# EAGLE design SlimeVRDiyModular (EAGLE 9.6.2)
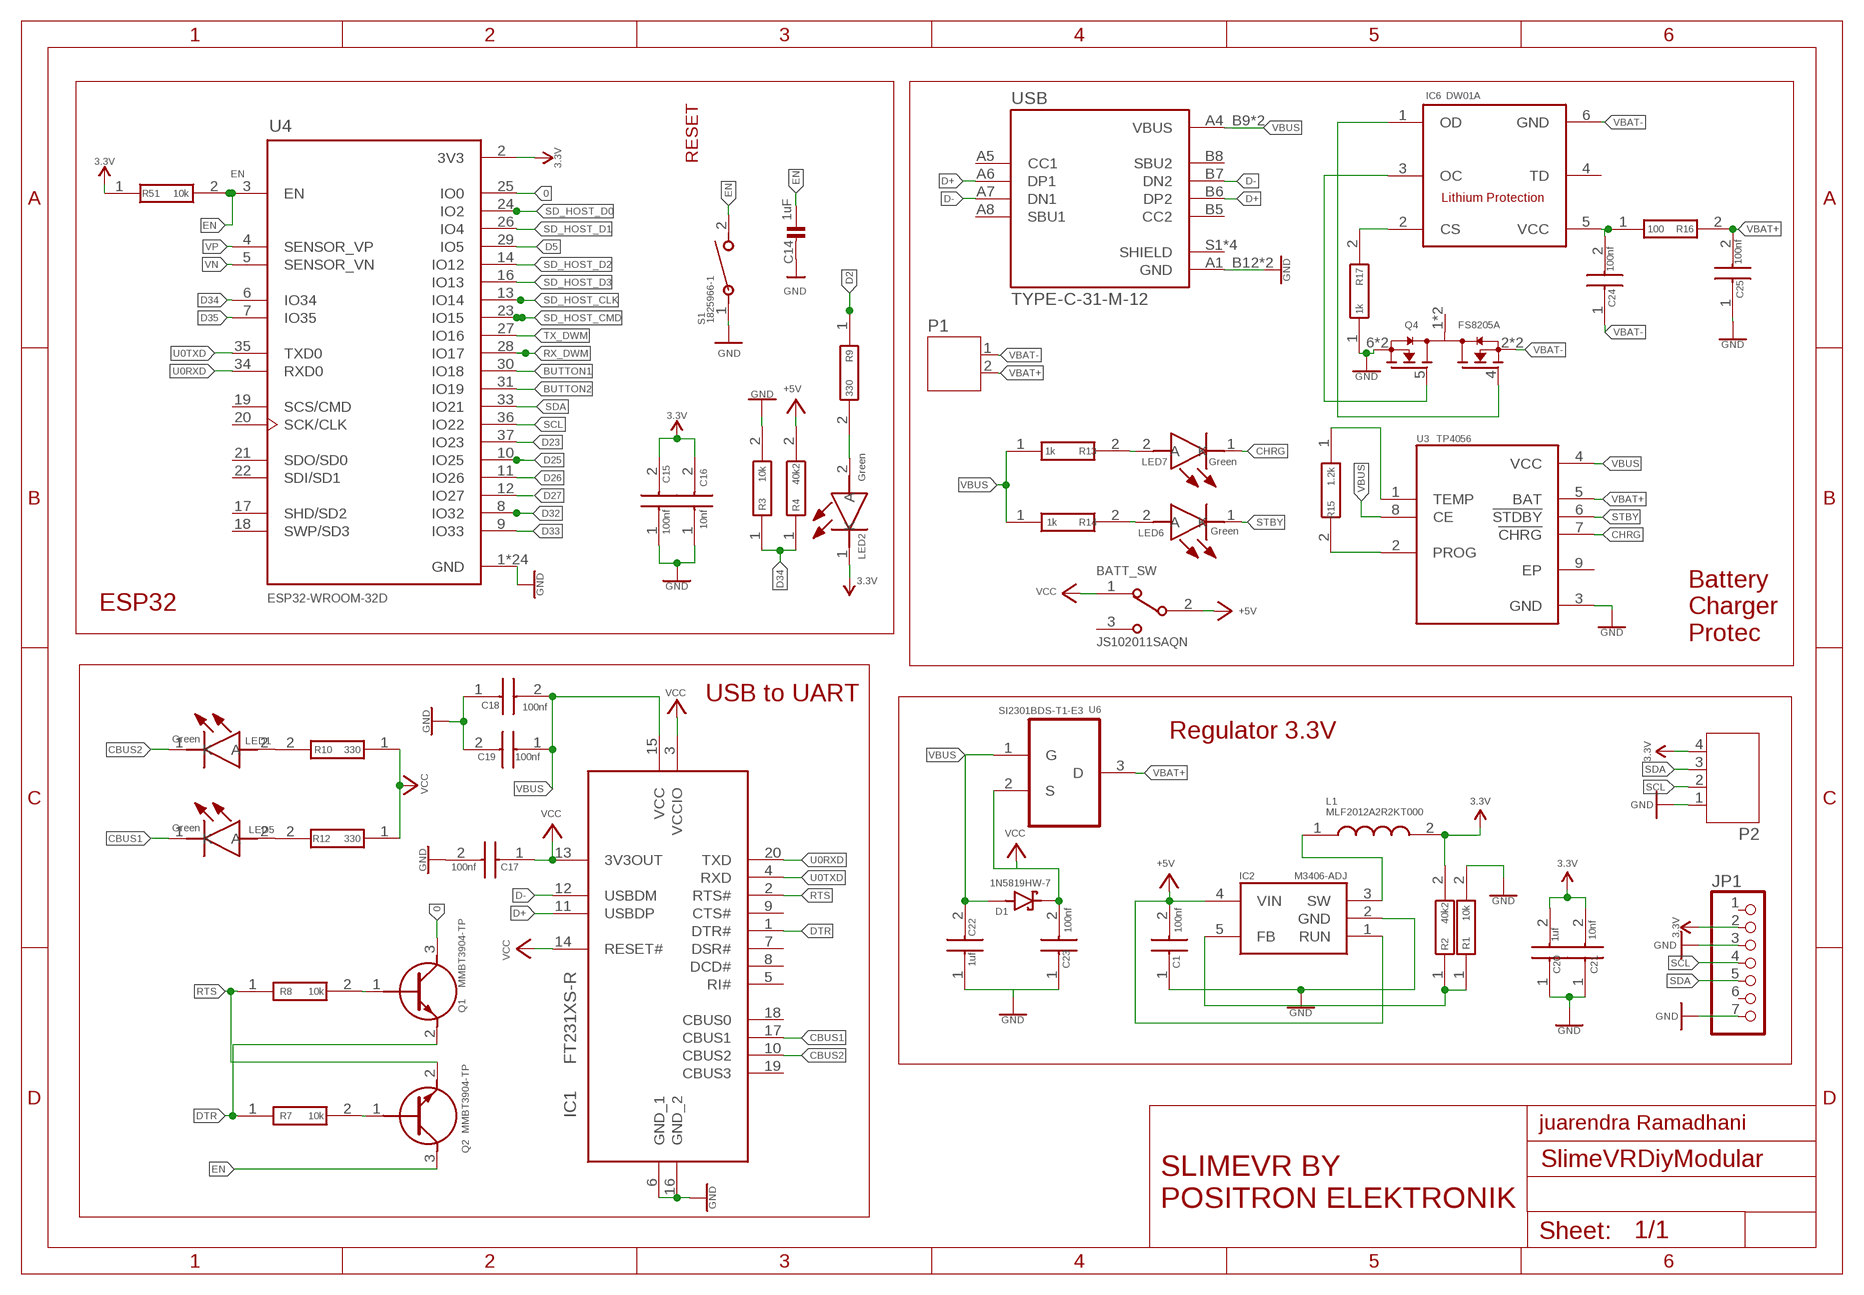
[diagram p0: schematic, sheet 1]

## Parts
BATT_SW  JS102011SAQN  [SW_JS102011SAQN]
C1  100nf  885012206071  [CAPC1608X87N]
C14  1uF  CAP_CERAMIC0603  [0603]
C15  100nf  885012206071  [CAPC1608X87N]
C16  10nf  885012206089  [CAPC1608X87N]
C17  100nf  885012206071  [CAPC1608X87N]
C18  100nf  885012206071  [CAPC1608X87N]
C19  100nf  885012206071  [CAPC1608X87N]
C20  1uf  885012206071  [CAPC1608X87N]
C21  10nf  885012206089  [CAPC1608X87N]
C22  1uf  885012206071  [CAPC1608X87N]
C23  100nf  885012206071  [CAPC1608X87N]
C24  100nf  885012206071  [CAPC1608X87N]
C25  100nf  885012206071  [CAPC1608X87N]
D1  1N5819HW-7  [SOD3715X145N]
IC1  FT231XS-R  [SOP64P599X175-20N]
IC2  M3406-ADJ  [SOT95P280X100-5N]
IC6  DW01A  [SOT23-6]
JP1  PINHD-1X7  [1X07]
L1  MLF2012A2R2KT000  [INDC2012X105N]
LED1  Green  150080BS75000  [LEDC2012X80N]
LED2  Green  150080BS75000  [LEDC2012X80N]
LED5  Green  150080BS75000  [LEDC2012X80N]
LED6  Green  150080BS75000  [LEDC2012X80N]
LED7  Green  150080BS75000  [LEDC2012X80N]
P1  JST-PH2  [JST-PH2]
P2  JST-PH4  [JST-PH4]
Q1  MMBT3904-TP  [SI2305TP]
Q2  MMBT3904-TP  [SI2305TP]
Q4  FS8205A  [SOP65P640X120-8N]
R1  10k  ESR03EZPJ103  [RESC1608X55N]
R2  40k2  ERJ-S03F4022V  [RESC1608X55N]
R3  10k  ESR03EZPJ103  [RESC1608X55N]
R4  40k2  ERJ-S03F4022V  [RESC1608X55N]
R7  10k  ESR03EZPJ103  [RESC1608X55N]
R8  10k  ESR03EZPJ103  [RESC1608X55N]
R9  330  ERJ-H3EF3300V  [ERJH3]
R10  330  ERJ-H3EF3300V  [ERJH3]
R12  330  ERJ-H3EF3300V  [ERJH3]
R13  1k  ESR03EZPJ102  [RESC1608X55N]
R14  1k  ESR03EZPJ102  [RESC1608X55N]
R15  1.2k  ESR03EZPJ102  [RESC1608X55N]
R16  100  ESR03EZPJ102  [RESC1608X55N]
R17  1k  ESR03EZPJ102  [RESC1608X55N]
R51  10k  ESR03EZPJ103  [RESC1608X55N]
S1  1825966-1  [SWDIP2_256X170P100]
U3  TP4056  [SOP127P600X175-9N]
U4  ESP32-WROOM-32D  [MODULE_ESP32-WROOM-32D]
U6  SI2301BDS-T1-E3  [SOT95P237X112-3N]
USB  TYPE-C-31-M-12  [HRO_TYPE-C-31-M-12]

## Nets
0: Q1.3(C) U4.25(IO0)
3.3V: C15.2 C16.2 C20.2 C21.2 JP1.2 L1.2 LED2.1(K) P2.4 R2.2 R51.1 U4.2(3V3)
+5V: BATT_SW.2 C1.2 IC2.1(RUN) IC2.4(VIN) R4.2
BUTTON1: U4.30(IO18)
BUTTON2: U4.31(IO19)
CBUS1: IC1.17(CBUS1) LED5.1(K)
CBUS2: IC1.10(CBUS2) LED1.1(K)
CHRG: LED7.1(K) U3.7(!CHRG)
D2: R9.1
D5: U4.29(IO5)
D23: U4.37(IO23)
D25: U4.10(IO25)
D26: U4.11(IO26)
D27: U4.12(IO27)
D32: U4.8(IO32)
D33: U4.9(IO33)
D34: R3.1 R4.1 U4.6(IO34)
D35: U4.7(IO35)
D+: IC1.11(USBDP) USB.A6(DP1) USB.B6(DP2)
D-: IC1.12(USBDM) USB.A7(DN1) USB.B7(DN2)
DTR: IC1.1(DTR#) Q1.2(E) R7.1
EN: C14.1 Q2.3(C) R51.2 S1.2 U4.3(EN)
GND: C1.1 C14.2 C15.1 C16.1 C17.2 C18.1 C19.2 C20.1 C21.1 C22.1 C23.1 C25.1 IC1.6(GND_1) IC1.16(GND_2) IC2.2(GND) JP1.3 JP1.7 P2.1 Q4.6(S2) Q4.7(S2) R1.2 R3.2 R17.1 S1.1 U3.3(GND) USB.A1_B12(GND) USB.B1_A12(GND)
N$1: IC2.3(SW) L1.1
N$3: IC2.5(FB) R1.1 R2.1
N$9: Q2.1(B) R7.2
N$11: Q1.1(B) R8.2
N$12: LED5.2(A) R12.2
N$13: LED1.2(A) R10.2
N$15: LED7.2(A) R13.2
N$16: LED6.2(A) R14.2
N$17: R15.1 U3.1(TEMP)
N$18: R15.2 U3.2(PROG)
N$19: C24.2 IC6.5(VCC) R16.1
N$20: IC6.1(OD) Q4.4(G1)
N$21: IC6.2(CS) R17.2
N$26: IC6.3(OC) Q4.5(G2)
N$27: LED2.2(A) R9.2
RTS: IC1.2(RTS#) Q2.2(E) R8.1
RX_DWM: U4.28(IO17)
SCL: JP1.4 P2.2 U4.36(IO22)
SD_HOST_CLK: U4.13(IO14)
SD_HOST_CMD: U4.23(IO15)
SD_HOST_D0: U4.24(IO2)
SD_HOST_D1: U4.26(IO4)
SD_HOST_D2: U4.14(IO12)
SD_HOST_D3: U4.16(IO13)
SDA: JP1.5 P2.3 U4.33(IO21)
STBY: LED6.1(K) U3.6(!STDBY)
TX_DWM: U4.27(IO16)
U0RXD: IC1.20(TXD) U4.34(RXD0)
U0TXD: IC1.4(RXD) U4.35(TXD0)
VBAT+: C25.2 P1.2 R16.2 U3.5(BAT) U6.3(D)
VBAT-: C24.1 IC6.6(GND) P1.1 Q4.2(S1) Q4.3(S1)
VBUS: C18.2 C19.1 C22.2 D1.A IC1.15(VCC) R13.1 R14.1 U3.4(VCC) U3.8(CE) U6.1(G) USB.A4_B9(VBUS) USB.B4_A9(VBUS)
VCC: BATT_SW.1 C17.1 C23.2 D1.C(K) IC1.3(VCCIO) IC1.13(3V3OUT) IC1.14(RESET#) R10.1 R12.1 U6.2(S)
VN: U4.5(SENSOR_VN)
VP: U4.4(SENSOR_VP)
Unconnected: BATT_SW.3 IC1.5(RI#) IC1.7(DSR#) IC1.8(DCD#) IC1.9(CTS#) IC1.18(CBUS0) IC1.19(CBUS3) IC6.4(TD) JP1.1 JP1.6 Q4.1(D12) Q4.8(D12) U3.9(EP) U4.17(SHD/SD2) U4.18(SWP/SD3) U4.19(SCS/CMD) U4.20(SCK/CLK) U4.21(SDO/SD0) U4.22(SDI/SD1) USB.A5(CC1) USB.A8(SBU1) USB.B5(CC2) USB.B8(SBU2) USB.S1(SHIELD) USB.S2(SHIELD) USB.S3(SHIELD) USB.S4(SHIELD)

## Notes on the sheet
- RESET
- ESP32
- Battery 
  Charger
  Protec
- USB to UART
- Regulator 3.3V
- juarendra Ramadhani
- SLIMEVR BY
  POSITRON ELEKTRONIK

## Power pins joined to a net without a drawn wire
GND: U4.1(GND) U4.15(GND) U4.38(GND) U4.39_1(GND) U4.39_2(GND) U4.39_3(GND) U4.39_4(GND) U4.39_5(GND) U4.39_6(GND) U4.39_7(GND) U4.39_8(GND) U4.39_9(GND) U4.39_10(GND) U4.39_11(GND) U4.39_12(GND) U4.39_13(GND) U4.39_14(GND) U4.39_15(GND) U4.39_16(GND) U4.39_17(GND) U4.39_18(GND) U4.39_19(GND) U4.39_20(GND) U4.39_21(GND)

## Library data of the parts
BATT_SW = JS102011SAQN:JS102011SAQN: JS10 Series SPDT On-On 6 V 0.3 A Gull Wing SMT Slide Switch http://www.snapeda.com/parts/JS102011SAQN/C%26K%20Components/view-part/ Check availability <https://pricing.snapeda.com/parts/JS102011SAQN/C%26K/view-part?ref=eda>; AVAILABILITY: In Stock; CHECK_PRICES: https://www.snapeda.com/parts/JS102011SAQN/C%2526K/view-part/?ref=eda; DESCRIPTION: Slide Switch SPDT Surface Mount, Right Angle; MF: C&K; MP: JS102011SAQN; PACKAGE: None; PRICE: None; PURCHASE-URL: https://pricing.snapeda.com/search?q=JS102011SAQN&ref=eda; SNAPEDA_LINK: https://www.snapeda.com/parts/JS102011SAQN/C%2526K/view-part/?ref=snap
C1 C15 C17-C19 C23-C25 = AccesControlNFC:885012206071: Wurth Elektronik 0603 WCAP-CSGP 100nF Ceramic Multilayer Capacitor, 25 V dc, +125C, X7R Dielectric, +/-10% Source: Datasheet <https://katalog.we-online.com/pbs/datasheet/885012206071.pdf>; DESCRIPTION: Wurth Elektronik 0603 WCAP-CSGP 100nF Ceramic Multilayer Capacitor, 25 V dc, +125C, X7R Dielectric, +/-10%; DIGIKEY_PARTNUMBER: 732-7989-1-ND; DIGIKEY_PRICE-STOCK: https://www.digikey.com/product-detail/en/w%C3%BCrth-elektronik/885012206071/732-7989-1-ND/5454616; HEIGHT: 0.87mm; MANUFACTURER_NAME: Wurth Elektronik; MANUFACTURER_PART_NUMBER: 885012206071; MOUSER_PART_NUMBER: 710-885012206071; MOUSER_PRICE-STOCK: https://www.mouser.co.uk/ProductDetail/Wurth-Elektronik/885012206071?qs=0KOYDY2FL2%2FEBQkuHgvarg%3D%3D
C14 = microbuilder:CAP_CERAMIC: Ceramic Capacitors 0402 - 0402 Surface Mount Capacitors 16pF 50V 5% [Digikey: 445-4899-2-ND] 18pF 50V 5% [Digikey: 490-1281-2-ND] 22pF 50V 5% [Digikey: 490-1283-2-ND] 68pF 50V 5% [Digikey: 490-1289-2-ND] 0.1uF 10V 10% [Digikey: 490-1318-2-ND] 1.0uF 6.3V 10% [Digikey: 490-1320-2-ND] 0603 - 0603 Surface Mount Capacitors 16 pF 50V 5% [Digikey: 445-5051-2-ND] 22 pF 50V [Digikey: PCC220ACVTR-ND] 33 pF 50V 5% [Digikey: 490-1415-1-ND] 56pF 50V 5% [Digikey: 490-1421-1-ND] 220pF 50V 5% [Digikey: 445-1285-1-ND] 680 pF 50V 2200 pF 50V 5% C0G [Digikey: 445-1297-1-ND] 5600 pF 100V 5% X7R [Digikey: 478-3711-1-ND] 0.1 µF 25V 10% [Digikey: PCC2277TR-ND] 0.22 µF 16V 10% X7R [Digikey: 445-1318-1-ND] 1.0 µF 25V 10% [Digikey: 445-5146-2-ND] 0603 - RF Specific 3pF 250V +/-0.1pF RF [Digikey: 712-1347-1-ND] 18 pF 250V 5% [Digikey: 478-3505-1-ND or 712-1322-1-ND] 56 pF 250V 5% C0G RF [Digikey: 490-4867-1-ND] 68 pF 250V RF [Digikey: 490-4868-1-ND] 0805 - 0805 Surface Mount Capacitors 220 pF 250V 2% RF Ceramic Capacitor [Digikey: 712-1398-1-ND] 1000 pF 50V 2% NP0 Ceramic Capacitor [Digikey: 478-3760-1-ND] 0.1 µF 25V 10% Ceramic Capacitor [Digikey: PCC1828TR-ND] 1.0 µF 16V 10% Ceramic Capacitor[Digikey: 490-1691-2-ND] 10.0 µF 10V 10% Ceramic Capacitor[Digikey: 709-1228-1-ND] 10.0 uF 16V 10% Ceramic Capacitor [Digikey: 478-5165-2-ND] 47 uF 6.3V 20% Ceramic Capacitor [Digikey: 587-1779-1-ND or 399-5506-1-ND] 1206 - 1206 Surface Mount Capacitors 47uF 10V 20% Ceramic Capacitor [Digikey: 490-5528-1-ND or 399-5508-1-ND or 445-6010-1-ND] 100uF 6.3V -20%, +80% Y5V Ceramic Capacitor (Digikey: 490-4512-1-ND, Mouser: 81-GRM31CF50J107ZE1L)
C16 C21 = AccesControlNFC:885012206089: Wurth Elektronik 0603 WCAP-CSGP 10nF Ceramic Multilayer Capacitor, 50 V dc, +125C, X7R Dielectric, +/-10% Source: Datasheet <https://katalog.we-online.com/pbs/datasheet/885012206089.pdf>; DESCRIPTION: Wurth Elektronik 0603 WCAP-CSGP 10nF Ceramic Multilayer Capacitor, 50 V dc, +125C, X7R Dielectric, +/-10%; DIGIKEY_PARTNUMBER: 732-8007-1-ND; DIGIKEY_PRICE-STOCK: https://www.digikey.com/product-detail/en/w%C3%BCrth-elektronik/885012206089/732-8007-1-ND/5454634; HEIGHT: 0.87mm; MANUFACTURER_NAME: Wurth Elektronik; MANUFACTURER_PART_NUMBER: 885012206089; MOUSER_PART_NUMBER: 710-885012206089; MOUSER_PRICE-STOCK: https://www.mouser.co.uk/ProductDetail/Wurth-Elektronik/885012206089?qs=0KOYDY2FL28GvSbKh319Tw%3D%3D
C20 C22 = AccesControlNFC:885012206071: Wurth Elektronik 0603 WCAP-CSGP 100nF Ceramic Multilayer Capacitor, 25 V dc, +125C, X7R Dielectric, +/-10% Source: Datasheet <https://katalog.we-online.com/pbs/datasheet/885012206071.pdf>; DESCRIPTION: Wurth Elektronik 0603 WCAP-CSGP 100nF Ceramic Multilayer Capacitor, 25 V dc, +125C, X7R Dielectric, +/-10%; DIGIKEY_PARTNUMBER: 732-7989-1-ND; DIGIKEY_PRICE-STOCK: https://www.digikey.com/product-detail/en/w%C3%BCrth-elektronik/885012206071/732-7989-1-ND/5454616; HEIGHT: 0.87mm; MANUFACTURER_NAME: Wurth Elektronik; MANUFACTURER_PART_NUMBER: 885012206071; MOUSER_PART_NUMBER: 710-885012206071; MOUSER_PRICE-STOCK: https://www.mouser.co.uk/ProductDetail/Wurth-Elektronik/885012206071?qs=0KOYDY2FL2%2FEBQkuHgvarg%3D%3D; VALUE: 100nf
D1 = 1N5819HW-7:1N5819HW-7: 1N5819HW Series 40 V 1 A Surface Mount Schottky Barrier Rectifier - SOD-123 Check availability <https://pricing.snapeda.com/parts/1N5819HW-7/Diodes%20Inc./view-part?ref=eda>; AVAILABILITY: In Stock; CHECK_PRICES: https://www.snapeda.com/parts/1N5819HW-7/Diodes+Inc./view-part/?ref=eda; DESCRIPTION: Diode Schottky 40 V 1A Surface Mount SOD-123; MF: Diodes Inc.; MP: 1N5819HW-7; PACKAGE: SOD-123 Fairchild Semiconductor; PRICE: None; PURCHASE-URL: https://www.snapeda.com/api/url_track_click_mouser/?unipart_id=51510&manufacturer=Diodes Inc.&part_name=1N5819HW-7&search_term=1n5819; SNAPEDA_LINK: https://www.snapeda.com/parts/1N5819HW-7/Diodes+Inc./view-part/?ref=snap
IC1 = AccesControlNFC:FT231XS-R: FTDI Chip FT231XS-R, Interface RS232, RS422, RS485, SIE, UART 3MBd, 5 V, 20-pin, SSOP Source: Datasheet; DESCRIPTION: FTDI Chip FT231XS-R, Interface RS232, RS422, RS485, SIE, UART 3MBd, 5 V, 20-pin, SSOP; HEIGHT: 1.753mm; MANUFACTURER_NAME: FTDI Chip; MANUFACTURER_PART_NUMBER: FT231XS-R; MOUSER_PART_NUMBER: 895-FT231XS-R; MOUSER_PRICE-STOCK: https://www.mouser.co.uk/ProductDetail/FTDI/FT231XS-R?qs=Gp1Yz1mis3WduRPsgrTbtg%3D%3D
IC2 = M3406:M3406-ADJ: Step-down type SOT-23-5 DC-DC Converters ROHS Source: Datasheet <https://www.lcsc.com/datasheet/lcsc_datasheet_2304140030_XI-AN-Aerosemi-Tech-M3406-ADJ_C83224.pdf>; DESCRIPTION: Step-down type SOT-23-5 DC-DC Converters ROHS; HEIGHT: 1mm; LCSC_PART_NUMBER: C83224; LCSC_PRICE-STOCK: https://www.lcsc.com/product-detail/DC-DC-Converters_XI-AN-Aerosemi-Tech-M3406-ADJ_C83224.html; MANUFACTURER_NAME: XI'AN Aerosemi Tech; MANUFACTURER_PART_NUMBER: M3406-ADJ
IC6 = DW01A:DW01A: Check availability <https://pricing.snapeda.com/parts/DW01A/Fortune%20Semiconductor/view-part?ref=eda>; AVAILABILITY: Not in stock; CHECK_PRICES: https://www.snapeda.com/parts/DW01A/Fortune+Semiconductor/view-part/?ref=eda; DESCRIPTION: One Cell Lithium-ion/Polymer Battery Protection IC; MF: Fortune Semiconductor; MP: DW01A; PACKAGE: SOT-23-6 Fortune Semiconductor; PRICE: None; SNAPEDA_LINK: https://www.snapeda.com/parts/DW01A/Fortune+Semiconductor/view-part/?ref=snap
JP1 = pinhead:PINHD-1X7: PIN HEADER
L1 = MLF2012A2R2KT000:MLF2012A2R2KT000: 2.2 H Shielded Multilayer Inductor 50 mA 500mOhm Max 0805 (2012 Metric) Source: Datasheet <https://product.tdk.com/system/files/dam/doc/product/inductor/inductor/smd/catalog/inductor_commercial_standard_mlf2012_en.pdf>; DESCRIPTION: 2.2 H Shielded Multilayer Inductor 50 mA 500mOhm Max 0805 (2012 Metric); HEIGHT: 1.05mm; MANUFACTURER_NAME: TDK; MANUFACTURER_PART_NUMBER: MLF2012A2R2KT000; MOUSER_PART_NUMBER: 810-MLF2012A2R2KT000; MOUSER_PRICE-STOCK: https://www.mouser.co.uk/ProductDetail/TDK/MLF2012A2R2KT000?qs=pLY5GE0xrmL3Y2Jw%2FEGjFg%3D%3D
LED1 LED2 LED5-LED7 = AccesControlNFC:150080BS75000: LED,Wurth Elektronik,150080BS75000 Wurth Elektronik 150080BS75000, WL-SMCW Series Blue LED, 470 nm 2012 (0805) Clear, Rectangle Lens SMD package Source: Datasheet <https://katalog.we-online.com/led/datasheet/150080BS75000.pdf>; DESCRIPTION: LED,Wurth Elektronik,150080BS75000 Wurth Elektronik 150080BS75000, WL-SMCW Series Blue LED, 470 nm 2012 (0805) Clear, Rectangle Lens SMD package; HEIGHT: 0.8mm; MANUFACTURER_NAME: Wurth Elektronik; MANUFACTURER_PART_NUMBER: 150080BS75000; MOUSER_PART_NUMBER: 710-150080BS75000; MOUSER_PRICE-STOCK: https://www.mouser.co.uk/ProductDetail/Wurth-Elektronik/150080BS75000?qs=2kOmHSv6VfT2tBo3UPVqAQ%3D%3D
P1 = jst-ph:JST-PH2
P2 = jst-ph:JST-PH4
Q1 Q2 = AccesControlNFC:MMBT3904-TP: Bipolar Transistors - BJT 40V Source: Datasheet <https://componentsearchengine.com/Datasheets/1/MMBT3904-TP.pdf>; DESCRIPTION: Bipolar Transistors - BJT 40V; HEIGHT: mm; MANUFACTURER_NAME: Micro Commercial Components (MCC); MANUFACTURER_PART_NUMBER: MMBT3904-TP; MOUSER_PART_NUMBER: 833-MMBT3904-TP; MOUSER_PRICE-STOCK: https://www.mouser.co.uk/ProductDetail/Micro-Commercial-Components-MCC/MMBT3904-TP?qs=KFo7JewZbUHicjDjIayULQ%3D%3D
Q4 = FS8205A:FS8205A: N/A Check availability <https://pricing.snapeda.com/parts/FS8205A/Fortune%20Semiconductor/view-part?ref=eda>; AVAILABILITY: Not in stock; CHECK_PRICES: https://www.snapeda.com/parts/FS8205A/Fortune+Semiconductor/view-part/?ref=eda; MF: Fortune Semiconductor; MP: FS8205A; PACKAGE: Package; PRICE: None; SNAPEDA_LINK: https://www.snapeda.com/parts/FS8205A/Fortune+Semiconductor/view-part/?ref=snap
R1 R3 R7 R8 R51 = AccesControlNFC:ESR03EZPJ103: Thick Film Resistors - SMD 0603 10Kohm 5% Anti Surge AEC-Q200 Source: Datasheet <https://componentsearchengine.com/Datasheets/1/ESR03EZPJ103.pdf>; DESCRIPTION: Thick Film Resistors - SMD 0603 10Kohm 5% Anti Surge AEC-Q200; DIGIKEY_PARTNUMBER: RHM10KDCT-ND; DIGIKEY_PRICE-STOCK: https://www.digikey.com/product-detail/en/rohm-semiconductor/ESR03EZPJ103/RHM10KDCT-ND/1762925; HEIGHT: 0.55mm; MANUFACTURER_NAME: ROHM Semiconductor; MANUFACTURER_PART_NUMBER: ESR03EZPJ103; MOUSER_PART_NUMBER: 755-ESR03EZPJ103; MOUSER_PRICE-STOCK: https://www.mouser.com/Search/Refine.aspx?Keyword=755-ESR03EZPJ103
R2 R4 = ERJ-S03F4022V:ERJ-S03F4022V: Thick Film Resistors - SMD 0603 40.2Kohms 1% Anti-Sulfur Source: Datasheet <https://componentsearchengine.com/Datasheets/1/ERJ-S03F4022V.pdf>; DESCRIPTION: Thick Film Resistors - SMD 0603 40.2Kohms 1% Anti-Sulfur; HEIGHT: 0.55mm; MANUFACTURER_NAME: Panasonic; MANUFACTURER_PART_NUMBER: ERJ-S03F4022V; MOUSER_PART_NUMBER: 667-ERJ-S03F4022V; MOUSER_PRICE-STOCK: https://www.mouser.com/Search/Refine.aspx?Keyword=667-ERJ-S03F4022V
R9 R10 R12 = AccesControlNFC:ERJ-H3EF3300V: Power Rating 0.125W,Resistance 330 Ohm,LxW(EIA) 1.6 x 0.8 (EIA:0603) mm Source: Datasheet <http://industrial.panasonic.com/cdbs/www-data/pdf/RDQ0000/ast-ind-151033.pdf>; DESCRIPTION: Power Rating 0.125W,Resistance 330 Ohm,LxW(EIA) 1.6 x 0.8 (EIA:0603) mm; HEIGHT: mm; MANUFACTURER_NAME: Panasonic; MANUFACTURER_PART_NUMBER: ERJ-H3EF3300V; MOUSER_PART_NUMBER: 667-ERJ-H3EF3300V; MOUSER_PRICE-STOCK: https://www.mouser.co.uk/ProductDetail/Panasonic/ERJ-H3EF3300V?qs=eP2BKZSCXI61roRLPi8W7w%3D%3D
R13 R14 R17 = AccesControlNFC:ESR03EZPJ102: Thick Film Resistors - SMD 0603 1Kohm 5% Anti Surge AEC-Q200 Source: Datasheet <http://www.rohm.com/web/global/datasheet/ESR01MZPF/esr-e>; DESCRIPTION: Thick Film Resistors - SMD 0603 1Kohm 5% Anti Surge AEC-Q200; DIGIKEY_PARTNUMBER: RHM1.0KDCT-ND; DIGIKEY_PRICE-STOCK: https://www.digikey.com/product-detail/en/rohm-semiconductor/ESR03EZPJ102/RHM1-0KDCT-ND/1762924; HEIGHT: 0.55mm; MANUFACTURER_NAME: ROHM Semiconductor; MANUFACTURER_PART_NUMBER: ESR03EZPJ102; MOUSER_PART_NUMBER: 755-ESR03EZPJ102; MOUSER_PRICE-STOCK: https://www.mouser.co.uk/ProductDetail/ROHM-Semiconductor/ESR03EZPJ102?qs=DyUWGjl%252BcVvjMuV%252BzioV7Q%3D%3D
R15 R16 = AccesControlNFC:ESR03EZPJ102: Thick Film Resistors - SMD 0603 1Kohm 5% Anti Surge AEC-Q200 Source: Datasheet <http://www.rohm.com/web/global/datasheet/ESR01MZPF/esr-e>; DESCRIPTION: Thick Film Resistors - SMD 0603 1Kohm 5% Anti Surge AEC-Q200; DIGIKEY_PARTNUMBER: RHM1.0KDCT-ND; DIGIKEY_PRICE-STOCK: https://www.digikey.com/product-detail/en/rohm-semiconductor/ESR03EZPJ102/RHM1-0KDCT-ND/1762924; HEIGHT: 0.55mm; MANUFACTURER_NAME: ROHM Semiconductor; MANUFACTURER_PART_NUMBER: ESR03EZPJ102; MOUSER_PART_NUMBER: 755-ESR03EZPJ102; MOUSER_PRICE-STOCK: https://www.mouser.co.uk/ProductDetail/ROHM-Semiconductor/ESR03EZPJ102?qs=DyUWGjl%252BcVvjMuV%252BzioV7Q%3D%3D; VALUE: 1k
S1 = Switches:1825966-1; BUILT_BY: EMA_UL_Team; CATEGORY: Tactile Switches; COPYRIGHT: Copyright (C) 2016 Accelerated Designs. All rights reserved; DESCRIPTION: FSMCH=3.5 X 6.0 X 4.3 TACT SWITCH, HT; MANUFACTURER_PART_NUMBER: 1825966-1; PART_STATUS: active; SERIES: Unknown; VENDOR: TE Connectivity
U3 = TP4056:TP4056: Complete single cell Li-Ion battery with a constant current / constant voltage linear charger Check availability <https://pricing.snapeda.com/parts/TP4056/NanJing%20Top%20Power%20ASIC%20Corp./view-part?ref=eda>; AVAILABILITY: Not in stock; CHECK_PRICES: https://www.snapeda.com/parts/TP4056/NanJing+Top+Power+ASIC+Corp./view-part/?ref=eda; DESCRIPTION: Complete single cell Li-Ion battery with a constant current / constant voltage linear charger; MF: NanJing Top Power ASIC Corp.; MP: TP4056; PACKAGE: Package; PRICE: None; SNAPEDA_LINK: https://www.snapeda.com/parts/TP4056/NanJing+Top+Power+ASIC+Corp./view-part/?ref=snap
U4 = AccesControlNFC:ESP32-WROOM-32D: Bluetooth, WiFi 802.11b/g/n, Bluetooth v4.2 + EDR, Class 1, 2 and 3 Transceiver Module 2.4GHz ~ 2.5GHz Integrated, Trace Surface Mount Check availability <https://pricing.snapeda.com/parts/ESP32-WROOM-32D/Espressif%20Systems/view-part?ref=eda>; AVAILABILITY: In Stock; DESCRIPTION: Bluetooth, WiFi 802.11b/g/n, Bluetooth v4.2 +EDR, Class 1, 2 and 3 Transceiver Module 2.4GHz ~ 2.5GHz Integrated; MF: Espressif Systems; MP: ESP32-WROOM-32D; PACKAGE: Module Espressif Systems; PRICE: None; PURCHASE-URL: https://pricing.snapeda.com/search/part/ESP32-WROOM-32D/?ref=eda
U6 = SI2301BDS-T1-E3:SI2301BDS-T1-E3: MOSFET Check availability <https://pricing.snapeda.com/parts/SI2301BDS-T1-E3/Vishay/view-part?ref=eda>; AVAILABILITY: In Stock; CHECK_PRICES: https://www.snapeda.com/parts/SI2301BDS-T1-E3/Vishay+Siliconix/view-part/?ref=eda; DESCRIPTION: MOSFET,P-Ch,VDSS -20V,RDS(ON) 0.08Ohm,ID -2.2A,TO-236 (SOT-23),PD 0.7W,VGS +/-8V | Siliconix / Vishay SI2301BDS-T1-E3; MF: Vishay; MP: SI2301BDS-T1-E3; PACKAGE: SOT-23-3 Vishay Siliconix; PRICE: None; PURCHASE-URL: https://www.snapeda.com/api/url_track_click_mouser/?unipart_id=277675&manufacturer=Vishay&part_name=SI2301BDS-T1-E3&search_term=si2301; SNAPEDA_LINK: https://www.snapeda.com/parts/SI2301BDS-T1-E3/Vishay+Siliconix/view-part/?ref=snap
USB = TYPE-C-31-M-12:TYPE-C-31-M-12: Check availability <https://pricing.snapeda.com/parts/TYPE-C-31-M-12/HRO%20Electronics%20Co.%2C%20Ltd./view-part?ref=eda>; AVAILABILITY: Not in stock; CHECK_PRICES: https://www.snapeda.com/parts/TYPE-C-31-M-12/HRO+Electronics+Co.%252C+Ltd./view-part/?ref=eda; DESCRIPTION: USB Connectors 24 Receptacle 1 8.94*7.3mm RoHS; MF: HRO Electronics Co., Ltd.; MP: TYPE-C-31-M-12; PACKAGE: Package; PRICE: None; SNAPEDA_LINK: https://www.snapeda.com/parts/TYPE-C-31-M-12/HRO+Electronics+Co.%252C+Ltd./view-part/?ref=snap

## Net classes
1 highpower: width 0.406 mm, drill 0.483 mm

## Board
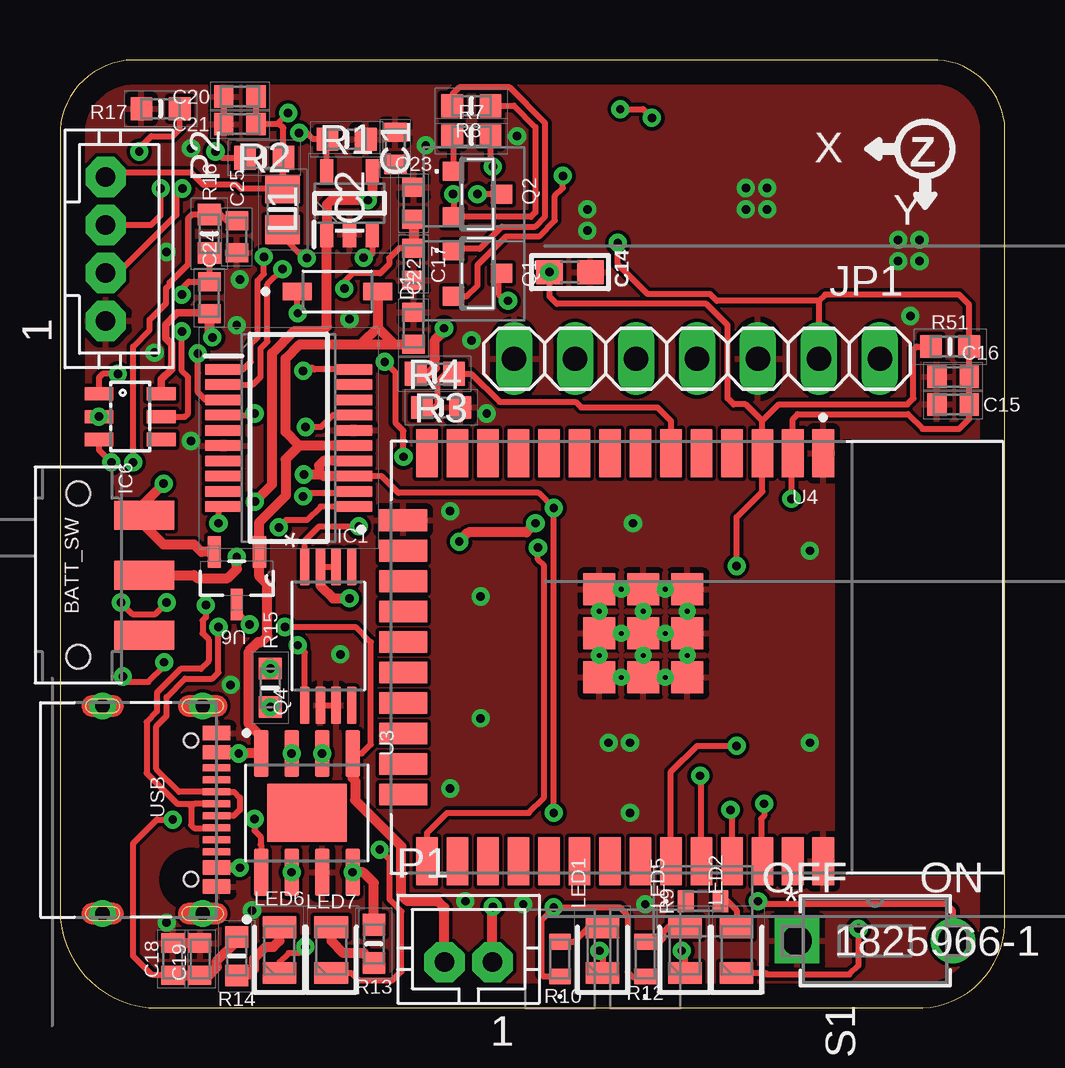
[diagram p1: board, top side]
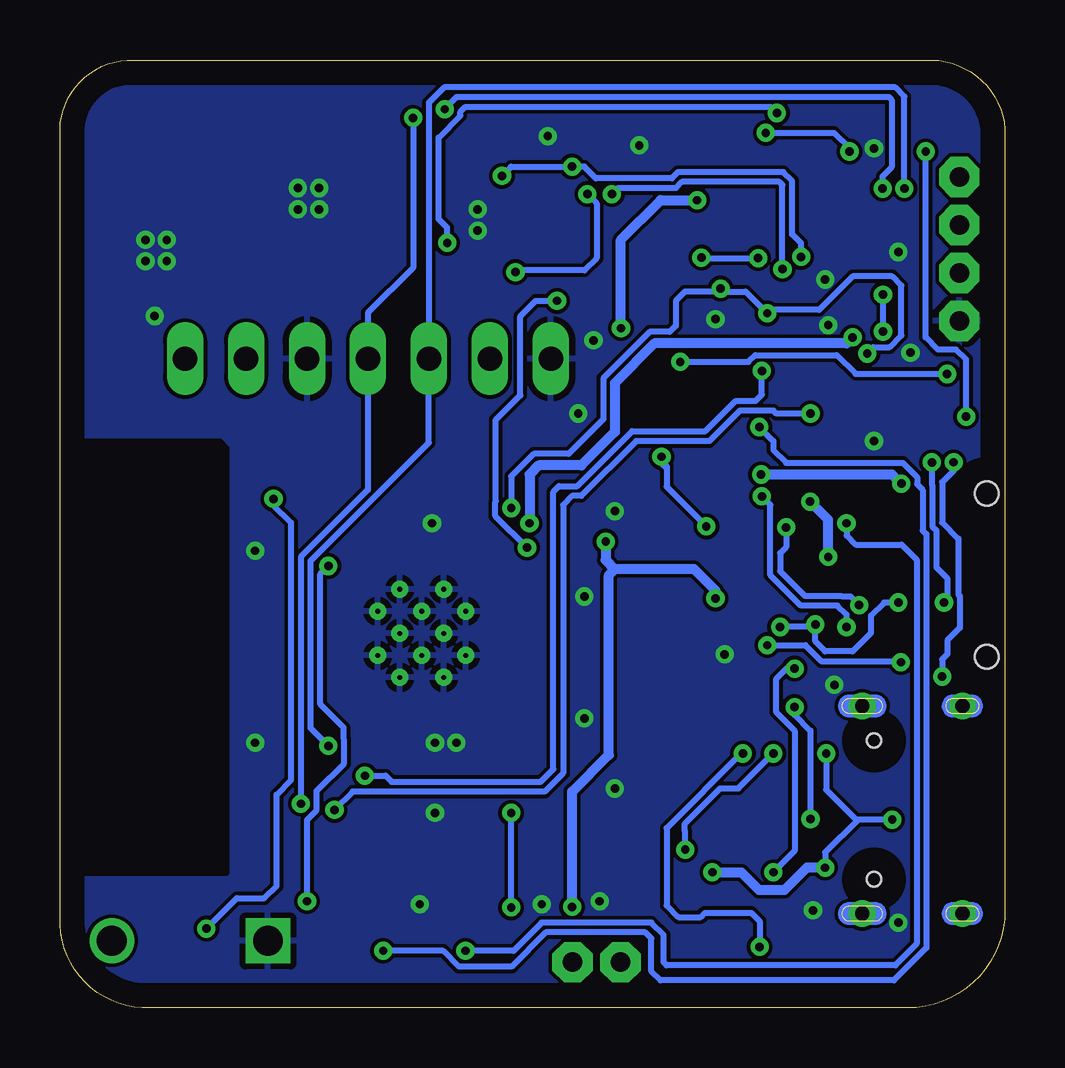
[diagram p2: board, bottom side, seen from below]

Size 39.37 x 39.5 mm. Coordinates in mm from the lower left corner, seen from the top.
Outline: 0,36.32 0,4.06 arc90 4.06,0 35.94,0 arc90 39.37,3.81 39.37,36.32 arc90 36.58,39.5 3.05,39.5 arc90 0,36.32
Copper layers (1*16): Top 0.035mm / dielectric 1.5mm / Bottom 0.035mm
Design rules "default *": minimum track width 6mil, minimum drill 0.35mm, track to track 6mil, track to pad 6mil, pad to pad 6mil, via to via 6mil, smd to smd 6mil, copper to edge 40mil, drill to drill 6mil, minimum pad ring 10mil, minimum via ring 8mil, stop-mask expansion 4mil, vias tented up to drill 0.36mm, thermal gap 10mil

### Footprints (pad centres in the part's own frame; a part is rotated, then mirrored left to right if it is on the bottom)
SW_JS102011SAQN = smd 1.2 x 2.5: 1 -2.5,2.75; 2 0,2.75; 3 2.5,2.75 | hole 1: -3.4,0; 3.4,0
CAPC1608X87N = smd 0.8 x 0.94: 1 -0.67,0; 2 0.67,0
0603 = smd 1.1 x 1: 1 -0.85,0; 2 0.85,0
SOD3715X145N = smd 1.21 x 0.73: A 1.68,0; C -1.68,0
SOP64P599X175-20N = smd 1.526 x 0.435: 1 -2.712,2.858; 2 -2.712,2.222; 3 -2.712,1.588; 4 -2.712,0.952; 5 -2.712,0.318; 6 -2.712,-0.318; 7 -2.712,-0.952; 8 -2.712,-1.588; 9 -2.712,-2.222; 10 -2.712,-2.858; 11 2.712,-2.858; 12 2.712,-2.222; 13 2.712,-1.588; 14 2.712,-0.952; 15 2.712,-0.318; 16 2.712,0.318; 17 2.712,0.952; 18 2.712,1.588; 19 2.712,2.222; 20 2.712,2.858
SOT95P280X100-5N = smd 1.05 x 0.55: 1 -1.3,0.95; 2 -1.3,0; 3 -1.3,-0.95; 4 1.3,-0.95; 5 1.3,0.95
SOT23-6 = smd 0.55 x 1.2: 1 -0.95,-1.3; 2 0,-1.3; 3 0.95,-1.3; 4 0.95,1.3; 5 0,1.3; 6 -0.95,1.3
1X07 = drill 1.016 long: 1 -7.62,0; 2 -5.08,0; 3 -2.54,0; 4 0,0; 5 2.54,0; 6 5.08,0; 7 7.62,0
INDC2012X105N = smd 1.2 x 1.45: 1 -0.85,0; 2 0.85,0
LEDC2012X80N = smd 0.9 x 1.4: 1 -0.95,0; 2 0.95,0
JST-PH2 = drill 0.813 pad 1.676 octagon: 1 1,0; 2 -1,0
JST-PH4 = drill 0.813 pad 1.676 octagon: 1 3,0; 2 1,0; 3 -1,0; 4 -3,0
SI2305TP = smd 0.8 x 0.9: 1 -0.95,-1; 2 0.95,-1; 3 0,1
SOP65P640X120-8N = smd 1.56 x 0.4: 1 -2.88,0.975; 2 -2.88,0.325; 3 -2.88,-0.325; 4 -2.88,-0.975; 5 2.88,-0.975; 6 2.88,-0.325; 7 2.88,0.325; 8 2.88,0.975
RESC1608X55N = smd 0.9 x 0.95: 1 -0.8,0; 2 0.8,0
RESC1608X55N' = smd 0.9 x 1: 1 -0.8,0; 2 0.8,0
ERJH3 = smd 0.65 x 0.9: 1 -0.725,0; 2 0.725,0
SWDIP2_256X170P100 = drill 1.245 pad 1.753 square: 1 -6.502,0 | drill 1.245 pad 1.753: 2 0,0
SOP127P600X175-9N = smd 1.97 x 0.6: 1 -2.475,1.905; 2 -2.475,0.635; 3 -2.475,-0.635; 4 -2.475,-1.905; 5 2.475,-1.905; 6 2.475,-0.635; 7 2.475,0.635; 8 2.475,1.905 | smd 2.413 x 3.302: 9 0,0
MODULE_ESP32-WROOM-32D = smd 2 x 0.9: 1 -8.5,5.26; 2 -8.5,3.99; 3 -8.5,2.72; 4 -8.5,1.45; 5 -8.5,0.18; 6 -8.5,-1.09; 7 -8.5,-2.36; 8 -8.5,-3.63; 9 -8.5,-4.9; 10 -8.5,-6.17; 11 -8.5,-7.44; 12 -8.5,-8.71; 13 -8.5,-9.98; 14 -8.5,-11.25; 25 8.5,-11.25; 26 8.5,-9.98; 27 8.5,-8.71; 28 8.5,-7.44; 29 8.5,-6.17; 30 8.5,-4.9; 31 8.5,-3.63; 32 8.5,-2.36; 33 8.5,-1.09; 34 8.5,0.18; 35 8.5,1.45; 36 8.5,2.72; 37 8.5,3.99; 38 8.5,5.26 | smd 0.9 x 2: 15 -5.715,-12.25; 16 -4.445,-12.25; 17 -3.175,-12.25; 18 -1.905,-12.25; 19 -0.635,-12.25; 20 0.635,-12.25; 21 1.905,-12.25; 22 3.175,-12.25; 23 4.445,-12.25; 24 5.715,-12.25 | smd 1.33 x 1.33: 39_1 -2.835,-0.405; 39_2 -1,-0.405; 39_3 0.835,-0.405; 39_4 -2.835,-2.24; 39_5 -1,-2.24; 39_6 0.835,-2.24; 39_7 -2.835,-4.075; 39_8 -1,-4.075; 39_9 0.835,-4.075 | drill 0.2 pad 0.3: 39_10 -1.917,-0.405; 39_11 -0.083,-0.405; 39_12 -2.835,-1.323; 39_13 -1,-1.323; 39_14 0.835,-1.323; 39_15 -1.917,-2.24; 39_16 -0.083,-2.24; 39_17 -2.835,-3.158; 39_18 -1,-3.158; 39_19 0.835,-3.158; 39_20 -1.917,-4.075; 39_21 -0.083,-4.075
SOT95P237X112-3N = smd 1.321 x 0.559: 1 -1.092,0.94; 2 -1.092,-0.94 | smd 1.321 x 0.508: 3 1.092,0
HRO_TYPE-C-31-M-12 = smd 0.6 x 1.14: A1_B12 -3.2,4.75; A4_B9 -2.4,4.75; B1_A12 3.2,4.75; B4_A9 2.4,4.75 | smd 0.3 x 1.14: A5 -1.25,4.75; A6 -0.25,4.75; A7 0.25,4.75; A8 1.25,4.75; B5 1.75,4.75; B6 0.75,4.75; B7 -0.75,4.75; B8 -1.75,4.75 | drill 0.6 pad 0.9: S1 -4.325,4.17; S2 4.325,4.17; S3 -4.325,0; S4 4.325,0 | hole 0.6: -2.89,3.68; 2.89,3.68

### Placement (x,y rotation side)
BATT_SW  0.76,18.03 270 top
C1  13.97,35.81 270 top
C14  21.25,30.66 0 top
C15  37.21,25.15 0 top
C16  37.21,26.29 0 top
C17  14.73,30.99 270 top
C18  4.7,2.03 270 top
C19  5.84,2.03 90 top
C20  7.49,37.97 0 top
C21  7.49,36.83 0 top
C22  14.73,28.32 270 top
C23  14.73,33.53 270 top
C24  6.22,29.59 90 top
C25  7.37,32.13 90 top
D1  11.56,29.84 0 top
IC1  9.53,23.75 0 top
IC2  12.06,33.53 90 top
IC6  2.92,24.64 270 top
JP1  26.54,27.05 180 top
L1  9.27,33.27 90 top
LED1  22.61,2.41 90 top
LED2  28.19,2.41 90 top
LED5  26.03,2.41 90 top
LED6  9.14,2.41 90 top
LED7  11.3,2.41 90 top
P1  17.02,1.91 0 top
P2  1.9,31.62 270 top
Q1  17.4,30.61 270 top
Q2  17.4,33.91 270 top
Q4  11.18,15.49 270 top
R1  11.94,36.19 0 top
R2  40k2  [RESC1608X55N']  8.51,35.43 0 top
R3  15.88,25.02 0 top
R4  40k2  [RESC1608X55N']  15.62,26.42 180 top
R7  17.15,36.32 180 top
R8  17.15,37.59 180 top
R9  26.8,4.45 0 top
R10  20.83,2.03 90 top
R12  24.38,2.03 90 top
R13  13.08,2.67 270 top
R14  7.37,2.16 270 top
R15  8.76,13.34 90 top
R16  6.22,32.26 90 top
R17  4.19,37.47 0 top
R51  37.08,27.56 180 top
S1  37.21,2.79 0 top
U3  10.29,8.13 90 top
U4  26.54,14.6 270 top
U6  7.37,17.91 270 top
USB  1.78,8.26 270 top

### Tracks (layer width: path | path; a pad name or v marks a point on that pad's centre or on a via)
0  (via drill 0.35)
  Top 0.254: U4.25 15.29,7.29 16.13,8.13 19.53,8.13 20.17,8.76 20.17,18.44 19.92,18.69 v19.92,19.18 | v18.67,29.46 18.54,29.46 18.29,29.72 18.29,30.5 Q1.3
  Bottom 0.254: v19.92,19.18 21.23,20.49 21.23,21.1 21.21,21.12 21.21,24.51 20.19,25.53 20.19,28.83 19.56,29.46 v18.67,29.46
3.3V  (via drill 0.35)
  Top 0.254: C20.2 C21.2 8.76,36.83 9.05,36.83 | 9.05,36.83 9.14,36.83 9.31,36.67 R2.2 9.31,34.84 9.27,34.8 L1.2 7.53,34.12 7.37,34.29 5.97,34.29 5.46,34.8 2.08,34.8 P2.4 | LED2.1 29.4,1.46 29.46,1.4 32.89,1.4 33.27,1.78 v33.27,3.3 | v30.48,21.21 30.48,23.05 U4.2 30.53,24.54 30.73,24.74 35.33,24.74 35.94,24.13 37.46,24.13 37.88,24.55 C15.2 C16.2 R51.1 37.88,29.3 37.46,29.72 31.88,29.72 31.62,29.46 | 31.62,29.46 JP1.2 | 31.62,29.46 27.37,29.46 27.09,29.74 24.49,29.74 23.24,30.99 v23.24,31.88 | v9.51,37.29 9.05,36.83
  Bottom 0.254: v33.27,3.3 32,4.57 30.86,4.57 30.35,5.08 30.35,8.89 29.74,9.5 29.74,20.22 30.48,20.95 v30.48,21.21 | v23.24,31.88 23.24,32.51 23.6,32.87 23.6,36.27 22.69,37.17 22.69,37.34 22.48,37.54 9.76,37.54 v9.51,37.29
+5V  (via drill 0.35)
  Top 0.254: C1.2 13.33,35.14 IC2.4
  Top 0.406: IC2.4 13.01,33.84 v12.83,33.66 11.3,33.66 11.12,33.47 IC2.1 11.12,28.39 10.94,28.21 9.77,28.21 8.84,27.28 8.84,21.81 v8.12,21.09 | R4.2 15.37,26.42 15.62,26.66 15.62,27.06 15.62,27.07 15.62,27.81 16,28.19 v16,28.32 | BATT_SW.2 5.59,18.03 5.72,17.91 6.99,17.91 7.37,18.29 v7.37,18.8
  Bottom 0.406: v16,28.32 16,32 14.35,33.66 v12.83,33.66 | v7.37,18.8 7.37,20.34 v8.12,21.09
CBUS1  (via drill 0.35)
  Top 0.254: IC1.17 11.37,24.7 10.87,24.2 v10.23,24.2 | v25.91,2.38 26.03,2.26 LED5.1
  Bottom 0.254: v10.23,24.2 9.65,23.62 9.65,23.24 9.12,22.71 4.25,22.71 3.66,22.12 3.66,21.82 3.43,21.59 3.43,19.89 3.28,19.74 3.28,2.5 4.63,1.14 14.35,1.14 14.73,1.52 14.73,2.9 14.99,3.15 19.14,3.15 20.56,1.73 22.75,1.73 23.41,2.38 v25.91,2.38
CBUS2  (via drill 0.35)
  Top 0.254: v22.48,2.38 22.61,2.26 LED1.1 | IC1.10 6.6,20.68 v6.6,20.19
  Bottom 0.254: v22.48,2.38 20.48,2.38 19.3,3.56 14.73,3.56 14.22,3.05 14.22,1.91 14.1,1.78 4.57,1.78 3.68,2.67 3.68,18.68 4.31,19.3 6.22,19.3 6.6,19.69 v6.6,20.19
CHRG  (via drill 0.35)
  Top 0.254: LED7.1 12.13,1.46 12.45,1.14 13.84,1.14 14.22,1.52 14.22,4.02 13.74,4.5 13.74,6.18 v13.32,6.59
  Bottom 0.254: v13.32,6.59 13.32,7.35 13.33,7.37 13.33,7.68 11.87,9.14 11.11,9.14 U3.7
  other vias: 9.65,10.6
D34
  Top 0.254: R3.1 15.62,25.02 15.75,25.15 15.75,26.11 16.05,26.42 R4.1 17.15,26.42 18.31,25.25 21.49,25.25 21.72,25.02 24.89,25.02 25.45,24.46 U4.6
D+  (via drill 0.35)
  Top 0.254: USB.A6 5.58,8.51 | 5.58,8.51 5.46,8.38 5.46,7.62 5.59,7.49 6.52,7.49 USB.B6 | IC1.11 10.86,20.89 10.29,20.32 9.42,20.32 v9.12,20.02 | v6.08,16.78 6.08,16.28 5.95,16.15 5.95,15.6 6.2,15.35 6.2,14.45 5.87,14.12 5.04,14.12 4.04,13.12 4.04,12.34 3.61,11.91 3.61,9.79 4.89,8.51 5.58,8.51
  Bottom 0.254: v9.12,20.02 9.12,19.2 9.37,18.95 9.37,18.2 8.34,17.17 6.82,17.17 6.79,17.14 6.44,17.14 v6.08,16.78
D-  (via drill 0.35)
  Top 0.254: USB.A7 7.24,8 7.49,8.26 7.49,8.76 7.25,9.01 USB.B7 4.97,9.01 4.01,9.95 4.01,11.74 4.45,12.17 4.45,12.95 5.21,13.72 6.35,13.72 6.6,13.97 v6.6,15.88 | v10.13,21.32 10.28,21.46 12.17,21.46 IC1.12
  Bottom 0.254: v6.6,15.88 6.6,16.38 6.99,16.76 8.51,16.76 9.78,18.03 9.78,20.96 v10.13,21.32
DTR  (via drill 0.35)
  Top 0.254: IC1.1 7.63,26.61 7.95,26.92 7.95,27.65 8.23,27.93 8.23,30.32 8.49,30.58 v8.49,31.29 | v18.03,35.05 17.95,35.14 R7.1 | Q1.2 16.96,29.66 17.4,30.1 17.4,30.96 18.58,32.15 19.96,32.15 20.62,32.81 20.62,33.83 20.95,34.16 v20.95,34.67
  Bottom 0.254: v8.49,31.29 8.49,31.86 8.87,32.23 8.87,34.46 9.23,34.82 13.63,34.82 13.88,34.57 17.04,34.57 17.53,35.05 v18.03,35.05 20.57,35.05 v20.95,34.67
EN  (via drill 0.35)
  Top 0.254: Q2.3 v17.4,33.91 | 29.26,24.46 U4.3 29.26,21.52 28.19,20.45 v28.19,18.41 | C14.1 20.4,29.64 20.7,29.34 26.92,29.34 27.81,28.45 27.81,25.4 28.07,25.15 28.57,25.15 29.26,24.46 | 29.26,24.46 29.95,25.15 35.31,25.15 35.56,25.4 35.56,27.43 35.69,27.56 R51.2 | S1.2 37.21,4.06 36.96,4.32 29.21,4.32 v29.08,4.45
  Bottom 0.254: v17.4,33.91 17.02,33.53 17.02,31.24 17.53,30.73 20.32,30.73 C14.1 | v29.08,4.45 29.08,7.83 28.68,8.24 28.68,9.04 27.54,10.18 27.54,11.19 27.56,11.22 27.56,11.68 28.52,12.65 28.52,18.09 v28.19,18.41
  other vias: 20.4,30.66
GND  (via drill 0.35)
  Top 0.254: C20.1 C21.1 | Q4.6 Q4.7
  Top 0.406: C19.2 C18.1
  other vias: 29.46,33.27 21.97,33.27 19.05,36.32 15.24,35.94 29.46,34.16 28.57,34.16 28.57,33.27 21.97,32.39 17.15,27.81 17.78,24.77 17.53,17.14 23.88,20.19 22.86,11.05 17.53,12.06 16.26,9.14 24.38,4.32 19.3,4.32 16.89,4.45 23.75,11.05 31.24,11.05 23.75,8.13 7.11,13.46 11.68,14.73 8,4.06 4.45,3.56 16.26,20.7 5.46,23.62 4.45,31.5 31.24,19.05 35.43,28.83 34.92,31.11 35.81,31.11 35.81,32 34.92,32 7.49,30.35 7.37,28.45 12.06,28.7 5.46,35.81 3.94,27.3
  pour Bottom: -0.13,-0.63 39.88,-0.63 39.88,5.46 32.38,5.46 32.26,5.59 32.26,23.37 32.64,23.75 39.37,23.75 39.5,23.88 39.5,39.5 39.37,39.62 0,39.62 -0.13,39.5
  pour Top: 39.88,5.46 32.38,5.46 32.26,5.59 32.26,23.37 32.64,23.75 39.37,23.75 39.5,23.88 39.5,39.5 39.37,39.62 0,39.62 -0.13,39.5 -0.13,-0.63 39.88,-0.63
N$1  (via drill 0.35)
  Top 0.254: IC2.3 13.01,31.43 12.85,31.27 v12.65,31.27 | v10.29,31.24 10.16,31.24 9.27,32.13 L1.1
  Bottom 0.254: v12.65,31.27 12.63,31.24 v10.29,31.24
N$3  (via drill 0.35)
  Top 0.254: IC2.5 11.12,36.17 R1.1 10.54,36.19 10.27,36.46 v9.97,36.46 | v6.48,35.69 6.73,35.43 R2.1
  Bottom 0.254: v9.97,36.46 7.13,36.46 6.48,35.81 v6.48,35.69
N$9
  Top 0.254: Q2.1 16.4,36.27 R7.2
N$11
  Top 0.254: Q1.1 16.46,31.62 17.48,31.62 18.41,32.55 19.79,32.55 20.22,32.98 20.22,36.87 18.74,38.35 16.64,38.35 16.34,38.06 R8.2
N$12
  Top 0.254: R12.2 24.98,2.76 25.15,2.92 25.15,3.17 25.33,3.36 LED5.2
N$13
  Top 0.254: R10.2 21.43,2.76 22.03,3.36 LED1.2
N$15
  Top 0.406: LED7.2 11.3,2.79 11.81,2.29 12.66,2.29 R13.2
N$16
  Top 0.406: R14.2 7.4,1.4 7.87,1.4 8.09,1.61 8.09,2.06 8.57,2.54 8.89,2.54 9.14,2.79 LED6.2
N$17  (via drill 0.35)
  Top 0.254: v8.11,7.87 8.11,7.39 8.36,7.14 8.36,6.81 8.38,6.78 U3.1
  Bottom 0.254: v8.76,12.53 8.76,12.21 8.11,11.56 v8.11,7.87
N$18  (via drill 0.35)
  Bottom 0.254: U3.2 8.76,6.54 8.76,11.56 9.53,12.32 9.53,13.72 9.11,14.13 R15.2
  other vias: 9.65,5.65 8.76,14.13
N$19  (via drill 0.35)
  Top 0.254: R16.1 C24.2 5.37,30.26 5.08,29.97 v5.08,29.72 | IC6.5 5.21,24.64 5.33,24.77 5.33,26.29 5.08,26.54 v5.08,28.19
  Bottom 0.254: v5.08,28.19 v5.08,29.72
N$20  (via drill 0.35)
  Top 0.254: Q4.4 10.2,19.47 10.79,20.07 v12.45,20.07 | v13.53,26.92 13.97,26.48 13.97,24.38 14.31,24.04 v14.31,22.96 | v2.41,26.42 1.78,26.42 1.62,26.26 IC6.1
  Bottom 0.254: v12.45,20.07 14.1,21.72 14.1,22.48 | 14.1,22.58 14.1,22.48 | v13.53,26.92 10.69,26.92 10.4,27.2 7.01,27.2 6.22,26.42 v2.41,26.42 | 14.1,22.48 14.31,22.69 v14.31,22.96
N$21  (via drill 0.35)
  Top 0.254: v3.3,35.69 3.3,35.81 3.81,36.32 4.7,36.32 4.99,36.61 R17.2
  Bottom 0.254: IC6.2 1.62,27.02 2.03,27.43 2.79,27.43 3.3,27.94 v3.3,35.69
  other vias: 1.62,24.64
N$26  (via drill 0.35)
  Top 0.254: Q4.5 10.2,14.82 v9.91,15.11 | IC6.3 1.62,23.25 v2.14,22.74 | v2.62,13.81 2.84,13.59 3.68,13.59 4.34,14.25 v4.34,14.4
  Bottom 0.254: v9.91,15.11 8.32,15.11 7.66,14.45 4.39,14.45 v4.34,14.4 | v2.14,22.74 2.14,22.38 2.62,21.9 2.62,20.23 1.95,19.55 1.95,17.23 1.88,17.16 1.88,15.84 2.4,15.31 2.4,14.74 2.62,14.53 v2.62,13.81
N$27
  Top 0.254: R9.2 27.81,4.45 28.19,4.06 LED2.2
RTS  (via drill 0.35)
  Top 0.254: IC1.2 8.04,25.97 8.36,26.29 8.36,27.48 8.64,27.76 8.64,30.15 v9.27,30.78 | v16.38,33.91 16.4,33.89 Q2.2 19.62,32.96 19.81,33.15 19.81,36.7 18.92,37.59 R8.1
  Bottom 0.254: v9.27,30.78 9.27,34.29 9.4,34.42 13.46,34.42 13.72,34.16 16.13,34.16 v16.38,33.91
SCL  (via drill 0.35)
  Top 0.254: P2.2 2.43,30.62 4.85,33.04 4.85,33.89 v5.1,34.14 | v23.34,37.45 24.3,37.45 v24.66,37.08 | v29.34,8.51 29.34,8 29.21,7.87 29.21,6.16 U4.36
  Bottom 0.254: v5.1,34.14 5.1,34.65 4.72,35.03 4.72,37.84 4.83,37.95 22.86,37.95 23.34,37.46 v23.34,37.45 | v24.66,37.08 24.66,30.84 26.54,28.96 JP1.4 26.54,21.59 29.34,18.8 v29.34,8.51
SDA  (via drill 0.35)
  Top 0.254: P2.3 3.79,32.62 4.19,33.02 v4.19,34.14 | U4.33 25.45,9.83 26.54,10.92 v28.19,10.92
  Bottom 0.254: v4.19,34.14 4.19,37.97 4.57,38.35 23.37,38.35 24,37.72 JP1.5 24,23.55 28.93,18.63 28.93,11.66 v28.19,10.92
STBY  (via drill 0.35)
  Top 0.254: v10.22,2.54 9.97,2.29 9.53,2.29 9.14,1.91 LED6.1
  Bottom 0.254: v10.22,2.54 10.22,3.62 10.57,3.96 12.51,3.96 12.68,3.79 13.61,3.79 14.1,4.28 14.1,7.49 10.99,10.6 U3.6
  other vias: 10.92,10.6
U0RXD  (via drill 0.35)
  Top 0.254: U4.34 26.72,9.62 v26.67,9.67 | v10.13,26.54 10.26,26.67 10.54,26.67 10.6,26.61 IC1.20
  Bottom 0.254: v26.67,9.67 25.8,9.67 25.55,9.42 19.34,9.42 18.82,9.95 18.82,21.5 18.58,21.74 17.82,21.74 15.54,24.03 12.49,24.03 11.22,25.3 10.39,25.3 10.13,25.55 v10.13,26.54
U0TXD  (via drill 0.35)
  Top 0.254: IC1.4 8.04,24.7 v8.11,24.77 | v27.94,8.26 27.99,8.2 U4.35
  Bottom 0.254: v8.11,24.77 9.53,24.77 9.65,24.89 11.05,24.89 12.32,23.62 15.37,23.62 17.65,21.34 18.03,21.34 18.41,20.95 18.41,9.78 19.18,9.02 27.18,9.02 v27.94,8.26
VBAT+  (via drill 0.35)
  Top 0.254: C25.2 6.95,32.8 6.69,33.06 R16.2 5.5,33.06 5.33,32.89 5.33,30.99 4.57,30.23 4.57,30.14 4.42,29.99 4.42,29.36 3.74,28.68 3.74,28.25 3.05,27.56 v3.05,22.73 | U3.5 12.57,10.6 12.95,10.98 12.95,15.24 12.32,15.88 v9.37,15.88 | U6.3 7.37,16.51 v7.9,15.97 | v2.54,16.89 3.02,16.41 3.97,16.41 v4.45,16.89
  Top 0.406: P1.2 16.02,4.17 15.75,4.45 14.48,4.45 14.22,4.7 14.22,6.73 12.29,8.66 12.29,9.48 12.19,9.58 U3.5
  Bottom 0.254: v9.37,15.88 8,15.88 v7.9,15.97 7.9,15.27 7.49,14.86 6.35,14.86 5.59,15.62 5.59,16.34 5.04,16.89 v4.45,16.89 | v3.05,22.73 3.05,21.78 3.02,21.76 3.02,20.06 2.86,19.89 2.86,18.35 2.41,17.91 2.41,17.02 v2.54,16.89
VBAT-  (via drill 0.35)
  Top 0.254: Q4.3 Q4.2
  Top 0.305: IC6.6 4.22,26.19 4.65,26.62 4.65,27.65 4.4,27.9 4.4,28.47 4.88,28.96 6.19,28.96 C24.1
  Top 0.406: P1.1 18.02,4.2 v18.03,4.21 | v12.06,17.06 11.38,17.06 10.85,17.6 Q4.3 | C24.1 6.22,28.07 v6.35,27.94 | v19.81,20.19 19.43,19.81 17.02,19.81 v16.64,19.43
  Bottom 0.406: v18.03,4.21 18.03,9.02 16.51,10.54 16.51,18.03 16.26,18.29 | 16.26,18.29 12.95,18.29 12.06,17.4 v12.06,17.06 | v6.35,27.94 6.6,27.69 14.61,27.69 16.26,26.03 16.26,24 17.65,22.61 19.43,22.61 19.81,22.23 v19.81,20.19 | v16.64,19.43 16.64,18.67 16.26,18.29
VBUS  (via drill 0.35)
  Top 0.254: R14.1 7.24,3.09 | C18.2 3.85,1.36 3.05,2.16 3.05,6.86 4.04,7.85 v4.7,7.85 | 7.56,10.6 v7.45,10.6
  Top 0.406: USB.A4_B9 7.51,10.66 7.56,10.6 U3.8 8.38,11.3 7.87,11.81 7.87,14.86 8.26,15.24 8.38,15.24 8.64,15.49 8.64,17.65 8.31,17.98 U6.1 8.31,20.24 9.4,21.34 9.4,22.86 9.97,23.43 | USB.B4_A9 7.48,5.85 v7.49,5.84 | C18.2 C19.1 6.19,1.36 6.54,1.71 6.54,1.96 7.37,2.79 R14.1 | IC1.15 9.97,23.43 | 9.97,23.43 9.4,24 9.4,27.05 10,27.65 12.57,27.65 | 12.57,27.65 13.94,27.65 | 13.94,27.65 C22.2 | D1.A 13.24,28.35 | 12.57,27.65 12.57,27.69 13.24,28.35 | 13.24,28.35 13.94,27.65 | R13.1 13.08,5.21 12.63,5.65 U3.4
  Bottom 0.254: v4.7,7.85 6.12,7.85 | v7.49,5.84 7.49,6.48 6.12,7.85 | v7.45,10.6 7.45,9.1 6.2,7.85 6.12,7.85
  Bottom 0.406: v7.49,5.84 8.26,5.84 9.18,4.92 10.25,4.92 10.99,5.65 U3.4
  other vias: 12.19,5.65
VCC  (via drill 0.35)
  Top 0.254: C17.1 14.13,31.66 13.72,31.24 13.72,30.99 13.33,30.61 12.19,30.61 11.85,30.26 v11.85,29.97 | v9.91,28.94 9.88,28.97 D1.C | R10.1 20.16,1.31 20.07,1.4 20.07,3.68 v20.57,4.19 23.32,4.19 23.59,3.93 23.59,3.85 23.66,3.78 23.66,1.49 23.84,1.31 R12.1 | IC1.13 13.4,22.16 14.1,21.46 19.94,21.46 v20.57,20.83 v20.57,8.13 | IC1.3 6.06,25.34 5.74,25.65 5.74,26.46 v5.74,27.27
  Top 0.406: U6.2 5.89,19 5.59,19.3 4.32,19.3 3.51,20.11 BATT_SW.1 3.51,21.04 v4.32,21.84 | 10.79,22.23 10.92,22.23 10.99,22.16 IC1.13 | 10.79,22.23 v10.16,22.23 | IC1.14 10.99,22.8 10.79,22.61 10.79,22.23 | C23.2 C17.1
  Bottom 0.254: v20.57,4.19 v20.57,8.13 | v5.74,27.27 5.47,27.53 4.81,27.53 4.32,28.02 4.32,30.1 4.7,30.48 6.35,30.48 7.75,29.08 9.77,29.08 v9.91,28.94 10.81,29.84 11.72,29.84 v11.85,29.97 11.98,29.84 13.33,29.84 13.72,29.46 13.72,28.42 13.97,28.17 14.81,28.17 16.74,26.23 16.74,24.54 18.19,23.09 19.63,23.09 20.57,22.14 v20.57,20.83
  Bottom 0.406: v4.32,21.84 4.7,22.23 v10.16,22.23

### Text on the board
tPlace: X | Z | Y